# Altium project OUT_FET.PrjPcb
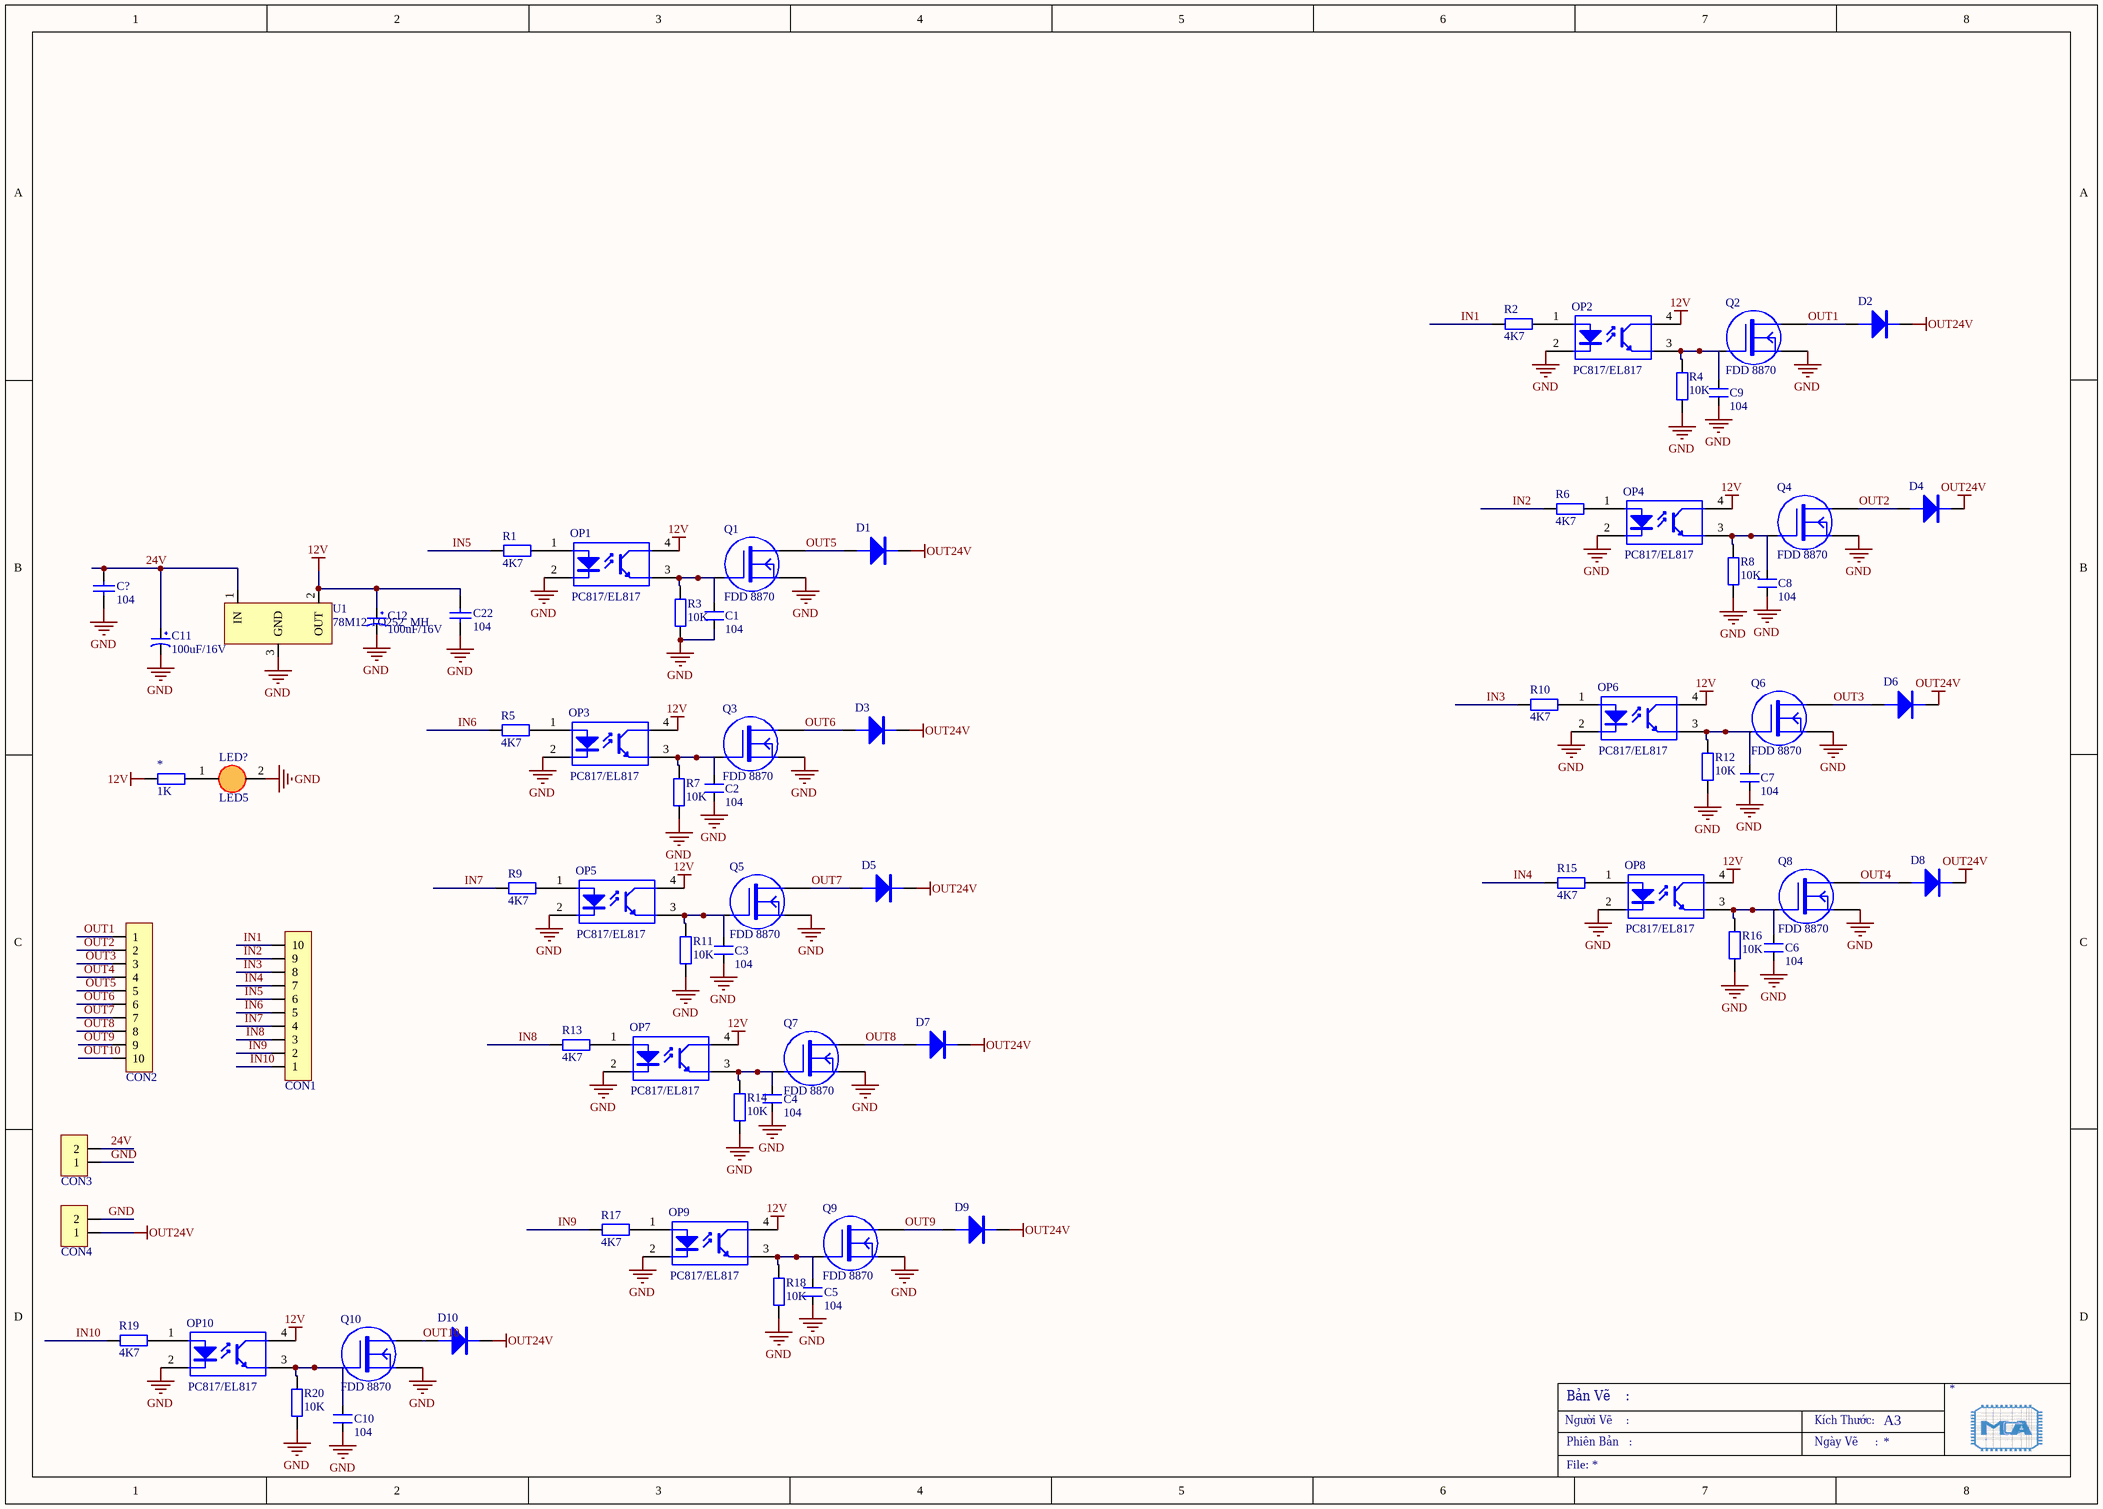
[diagram p0: OUT_FET_SCH.SchDoc]
1 sheet, 71 parts. Net scope: global (net labels, ports and power ports of the same name join across sheets).
Board file: OUT_FET_PCB.PcbDoc

## Sheet OUT_FET_SCH.SchDoc
size A3

### Parts
*  1K  [TRO_VACH_ 1/4W]
C1  104  [TU_GOM(104-->105pF)]
C2  104  [TU_GOM(104-->105pF)]
C3  104  [TU_GOM(104-->105pF)]
C4  104  [TU_GOM(104-->105pF)]
C5  104  [TU_GOM(104-->105pF)]
C6  104  [TU_GOM(104-->105pF)]
C7  104  [TU_GOM(104-->105pF)]
C8  104  [TU_GOM(104-->105pF)]
C9  104  [TU_GOM(104-->105pF)]
C10  104  [TU_GOM(104-->105pF)]
C11  100uF/16V  [TU_HOA(100uF/35V - 470uF/16V)]
C12  100uF/16V  [TU_HOA(100uF/35V - 470uF/16V)]
C22  104  [TU_SMD_0805]
C?  104  [TU_SMD_0805]
CON1  CON 10 KF762_MH  [CON 10 KF762]  (value not drawn)
CON2  CON 10 KF762_MH  [CON 10 KF762]  (value not drawn)
CON3  CON 2 KF762_MH  [Con 2 KF762]  (value not drawn)
CON4  CON 2 KF762_MH  [Con 2 KF762]  (value not drawn)
D1  Diode TVS P6KE30A 30V SMBJ30A  [SOD80]  (value not drawn)
D2  Diode TVS P6KE30A 30V SMBJ30A  [SOD80]  (value not drawn)
D3  Diode TVS P6KE30A 30V SMBJ30A  [SOD80]  (value not drawn)
D4  Diode TVS P6KE30A 30V SMBJ30A  [SOD80]  (value not drawn)
D5  Diode TVS P6KE30A 30V SMBJ30A  [SOD80]  (value not drawn)
D6  Diode TVS P6KE30A 30V SMBJ30A  [SOD80]  (value not drawn)
D7  Diode TVS P6KE30A 30V SMBJ30A  [SOD80]  (value not drawn)
D8  Diode TVS P6KE30A 30V SMBJ30A  [SOD80]  (value not drawn)
D9  Diode TVS P6KE30A 30V SMBJ30A  [SOD80]  (value not drawn)
D10  Diode TVS P6KE30A 30V SMBJ30A  [SOD80]  (value not drawn)
LED?  LED5  [LED 5mm DO]
OP1  PC817  [DIP4]  (value not drawn)
OP2  PC817  [DIP4]  (value not drawn)
OP3  PC817  [DIP4]  (value not drawn)
OP4  PC817  [DIP4]  (value not drawn)
OP5  PC817  [DIP4]  (value not drawn)
OP6  PC817  [DIP4]  (value not drawn)
OP7  PC817  [DIP4]  (value not drawn)
OP8  PC817  [DIP4]  (value not drawn)
OP9  PC817  [DIP4]  (value not drawn)
OP10  PC817  [DIP4]  (value not drawn)
Q1  FDD 8870  [TO220F]
Q2  FDD 8870  [TO220F]
Q3  FDD 8870  [TO220F]
Q4  FDD 8870  [TO220F]
Q5  FDD 8870  [TO220F]
Q6  FDD 8870  [TO220F]
Q7  FDD 8870  [TO220F]
Q8  FDD 8870  [TO220F]
Q9  FDD 8870  [TO220F]
Q10  FDD 8870  [TO220F]
R1  4K7  [Tro SMD 0805]
R2  4K7  [Tro SMD 0805]
R3  10K  [TRO_SMD_1206]
R4  10K  [TRO_SMD_1206]
R5  4K7  [Tro SMD 0805]
R6  4K7  [Tro SMD 0805]
R7  10K  [TRO_SMD_1206]
R8  10K  [TRO_SMD_1206]
R9  4K7  [Tro SMD 0805]
R10  4K7  [Tro SMD 0805]
R11  10K  [TRO_SMD_1206]
R12  10K  [TRO_SMD_1206]
R13  4K7  [Tro SMD 0805]
R14  10K  [TRO_SMD_1206]
R15  4K7  [Tro SMD 0805]
R16  10K  [TRO_SMD_1206]
R17  4K7  [Tro SMD 0805]
R18  10K  [TRO_SMD_1206]
R19  4K7  [Tro SMD 0805]
R20  10K  [TRO_SMD_1206]
U1  78M12 TO252_MH  [TO220F]

### Nets
12V: *.1 C12.1 C22.2 OP1.4 OP2.4 OP3.4 OP4.4 OP5.4 OP6.4 OP7.4 OP8.4 OP9.4 OP10.4 U1.2(OUT)
GND: C1.1 C2.1 C3.1 C4.1 C5.1 C6.1 C7.1 C8.1 C9.1 C10.1 C11.2 C12.2 C22.1 C?.1 CON3.1 CON4.2 LED?.2(K) OP1.2 OP2.2 OP3.2 OP4.2 OP5.2 OP6.2 OP7.2 OP8.2 OP9.2 OP10.2 Q1.3(S) Q2.3(S) Q3.3(S) Q4.3(S) Q5.3(S) Q6.3(S) Q7.3(S) Q8.3(S) Q9.3(S) Q10.3(S) R3.1 R4.1 R7.1 R8.1 R11.1 R12.1 R14.1 R16.1 R18.1 R20.1 U1.3(GND)
OUT24V: CON4.1 D1.2 D2.2 D3.2 D4.2 D5.2 D6.2 D7.2 D8.2 D9.2 D10.2
24V: C11.1 C?.2 CON3.2 U1.1(IN)
IN1: CON1.10 R2.2
IN2: CON1.9 R6.2
IN3: CON1.8 R10.2
IN4: CON1.7 R15.2
IN5: CON1.6 R1.2
IN6: CON1.5 R5.2
IN7: CON1.4 R9.2
IN8: CON1.3 R13.2
IN9: CON1.2 R17.2
IN10: CON1.1 R19.2
OUT1: CON2.1 D2.1 Q2.2(D)
OUT2: CON2.2 D4.1 Q4.2(D)
OUT3: CON2.3 D6.1 Q6.2(D)
OUT4: CON2.4 D8.1 Q8.2(D)
OUT5: CON2.5 D1.1 Q1.2(D)
OUT6: CON2.6 D3.1 Q3.2(D)
OUT7: CON2.7 D5.1 Q5.2(D)
OUT8: CON2.8 D7.1 Q7.2(D)
OUT9: CON2.9 D9.1 Q9.2(D)
OUT10: CON2.10 D10.1 Q10.2(D)
Net*_2: *.2 LED?.1(A)
NetC1_2: C1.2 OP1.3 Q1.1(G) R3.2
NetC2_2: C2.2 OP3.3 Q3.1(G) R7.2
NetC3_2: C3.2 OP5.3 Q5.1(G) R11.2
NetC4_2: C4.2 OP7.3 Q7.1(G) R14.2
NetC5_2: C5.2 OP9.3 Q9.1(G) R18.2
NetC6_2: C6.2 OP8.3 Q8.1(G) R16.2
NetC7_2: C7.2 OP6.3 Q6.1(G) R12.2
NetC8_2: C8.2 OP4.3 Q4.1(G) R8.2
NetC9_2: C9.2 OP2.3 Q2.1(G) R4.2
NetC10_2: C10.2 OP10.3 Q10.1(G) R20.2
NetOP1_1: OP1.1 R1.1
NetOP2_1: OP2.1 R2.1
NetOP3_1: OP3.1 R5.1
NetOP4_1: OP4.1 R6.1
NetOP5_1: OP5.1 R9.1
NetOP6_1: OP6.1 R10.1
NetOP7_1: OP7.1 R13.1
NetOP8_1: OP8.1 R15.1
NetOP9_1: OP9.1 R17.1
NetOP10_1: OP10.1 R19.1

### Notes on the sheet
- Người Vẽ    :
- Phiên Bản   :
- Bản Vẽ    :
- Kích Thước:
- Ngày Vẽ     :
- A3
- File:
- (in symbol PC817/EL817 5V 5mA SMD_MH) PC817/EL817

### Library data of the parts
* = TRO_VACH_1/4W_MH
C1-C10 = TU_GOM(104 => 105pF)_MH: Value: 0.1uF
C11 C12 = TU_HOA_100uF_50V_MH: TU_HOA_100uF_50V; Value: 100uF/35V/50V; Description 1: 1000uF/6,3V - 470uF/16V - 330uF - 25V; Description 2: 220uF/35V - 100uF/50V - 63V - 4,7uF/200V; Description 3: 22uF => 33uF100V - 3,3uF => 4,7uF/250V; Description 4: 2,2uF =>3,3uF/350 - 2,2uF/400V - 1uF/450V
C22 C? = TU_SMD_0805_MH
CON1 CON2 = CON 10 KF762_MH: CON 10 KF762 - 10P 7.62mm
CON3 CON4 = CON 2 KF762_MH: CON 2 KF762 - 2P 7.62mm
D1-D10 = Diode 1N4148 SOD80 450mA 100V ( LL34 1N4148 SMD)_MH: Diode 1N4148 SOD80 450mA 100V ( LL34 1N4148 SMD)
LED? = LED 5mm_MH: LED 5mm
OP1-OP10 = PC817/EL817 5V 5mA SMD_MH
R1-R20 = TRO_SMD_1206_MH
U1 = 78M12 TO252_MH: pin to pad: 2>3 3>2